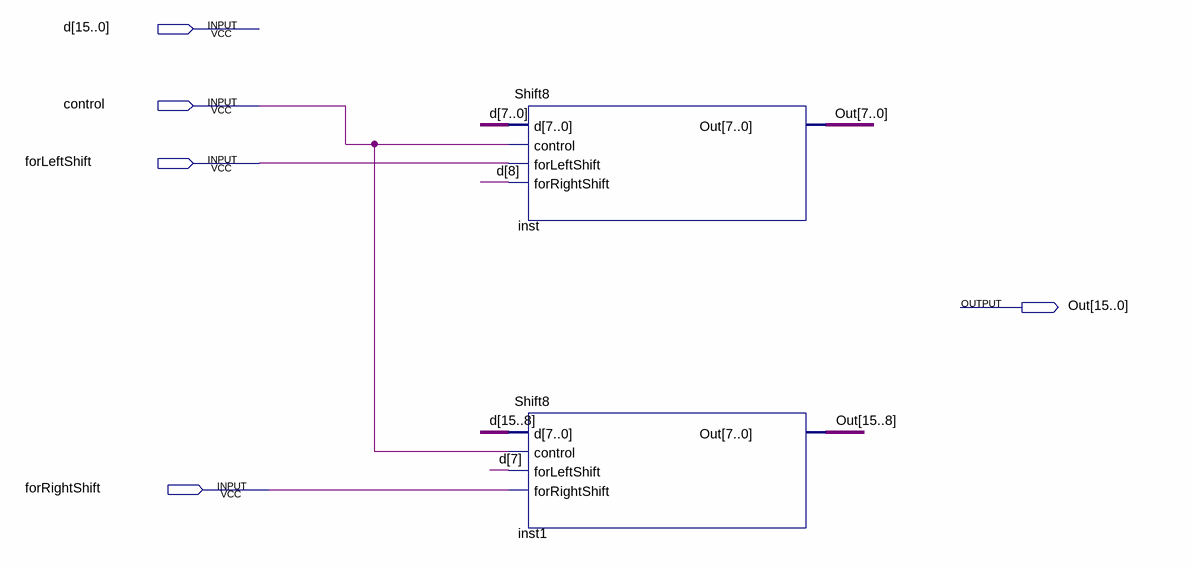
[diagram p0: schematic sheet]
// Quartus schematic Shift16.bdf as structural Verilog: 2 symbols, 5 pins
module Shift16 (
  input  [15:0] d,
  input  control,
  input  forLeftShift,
  input  forRightShift,
  output [15:0] Out
);

  Shift8 inst (.d(d[7:0]), .control(control), .forLeftShift(forLeftShift), .forRightShift(d[8]), .Out(Out[7:0]));
  Shift8 inst1 (.d(d[15:8]), .control(control), .forLeftShift(d[7]), .forRightShift(forRightShift), .Out(Out[15:8]));
endmodule
